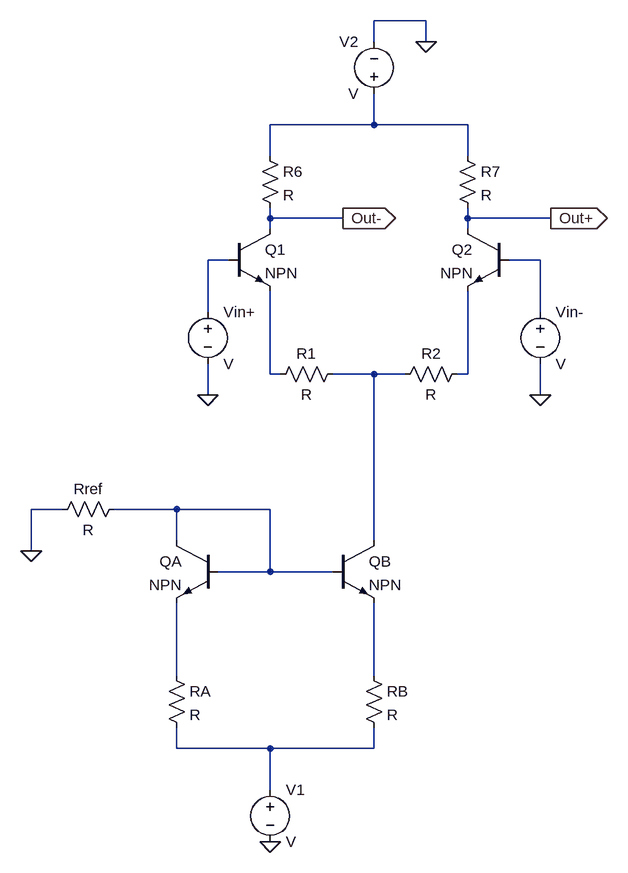
[diagram p0: schematic BJT_Diff_amp.asc]
BJT_Diff_amp.asc, the LTspice schematic file:
Version 4
SHEET 1 948 1044
WIRE 240 -240 160 -240
WIRE 160 -208 160 -240
WIRE 240 -208 240 -240
WIRE 160 -80 160 -128
WIRE 160 -80 0 -80
WIRE 304 -80 160 -80
WIRE 0 -32 0 -80
WIRE 304 -32 304 -80
WIRE 0 64 0 48
WIRE 112 64 0 64
WIRE 304 64 304 48
WIRE 432 64 304 64
WIRE 0 80 0 64
WIRE 304 80 304 64
WIRE -64 128 -96 128
WIRE 416 128 368 128
WIRE -96 208 -96 128
WIRE 416 208 416 128
WIRE 0 304 0 176
WIRE 16 304 0 304
WIRE 160 304 96 304
WIRE 208 304 160 304
WIRE 304 304 304 176
WIRE 304 304 288 304
WIRE -96 336 -96 288
WIRE 416 336 416 288
WIRE -320 512 -368 512
WIRE -144 512 -240 512
WIRE 0 512 -144 512
WIRE -144 560 -144 512
WIRE 160 560 160 304
WIRE -368 576 -368 512
WIRE 0 608 0 512
WIRE 0 608 -80 608
WIRE 96 608 0 608
WIRE -144 768 -144 656
WIRE 160 768 160 656
WIRE -144 880 -144 848
WIRE 0 880 -144 880
WIRE 160 880 160 848
WIRE 160 880 0 880
WIRE 0 944 0 880
FLAG -96 336 0
FLAG 416 336 0
FLAG -368 576 0
FLAG 0 1024 0
FLAG 240 -208 0
FLAG 432 64 Out+
IOPIN 432 64 Out
FLAG 112 64 Out-
IOPIN 112 64 Out
SYMBOL npn 368 80 M0
SYMATTR InstName Q2
SYMBOL npn -64 80 R0
SYMATTR InstName Q1
SYMBOL res 112 288 R90
WINDOW 0 0 56 VBottom 2
WINDOW 3 32 56 VTop 2
SYMATTR InstName R1
SYMBOL res 304 288 R90
WINDOW 0 0 56 VBottom 2
WINDOW 3 32 56 VTop 2
SYMATTR InstName R2
SYMBOL npn 96 560 R0
SYMATTR InstName QB
SYMBOL npn -80 560 M0
SYMATTR InstName QA
SYMBOL res -160 752 R0
SYMATTR InstName RA
SYMBOL res 144 752 R0
SYMATTR InstName RB
SYMBOL res -224 496 R90
WINDOW 0 0 56 VBottom 2
WINDOW 3 32 56 VTop 2
SYMATTR InstName Rref
SYMBOL voltage 0 928 R0
SYMATTR InstName V1
SYMBOL voltage 160 -112 R180
WINDOW 0 24 96 Left 2
WINDOW 3 24 16 Left 2
SYMATTR InstName V2
SYMBOL res -16 -48 R0
SYMATTR InstName R6
SYMBOL res 288 -48 R0
SYMATTR InstName R7
SYMBOL voltage -96 192 R0
SYMATTR InstName Vin+
SYMBOL voltage 416 192 R0
SYMATTR InstName Vin-

The netlist it stands for:
* BJT_Diff_amp.asc
Q2 Out+ N003 N006 0 NPN
Q1 Out- N002 N004 0 NPN
R1 N005 N004 R
R2 N006 N005 R
QB N005 N007 N009 0 NPN
QA N007 N007 N008 0 NPN
RA N008 N010 R
RB N009 N010 R
Rref N007 0 R
V1 N010 0 V
V2 N001 0 V
R6 N001 Out- R
R7 N001 Out+ R
Vin+ N002 0 V
Vin- N003 0 V
.model NPN NPN
.model PNP PNP
.lib standard.bjt
.backanno
.end